# Altium schematic sheet LED Driver.SchDoc: MicroBAR - LED Driver Circuit
size A; DrawnBy: Frankie Myers; Engineer: Frankie Myers; Organization: UC Berkeley
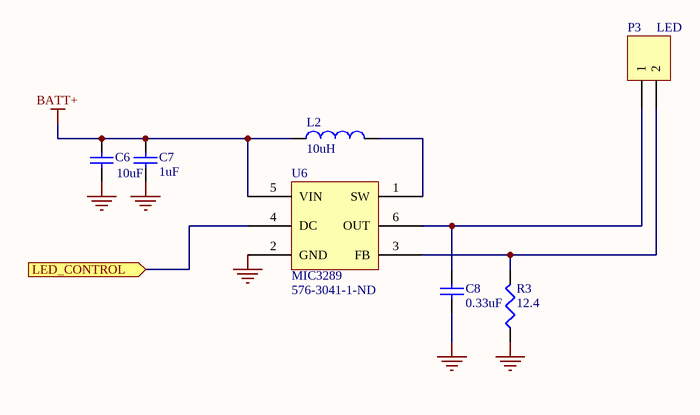
[diagram p0: LED Driver.SchDoc]

## Parts
C6  value 10uF  [CAPC3216L]  (hidden comment: Cap)
C7  value 1uF  [CAPC3216L]  (hidden comment: Cap Semi)
C8  value 0.33uF  [CAPC3216L]  (hidden comment: Cap Semi)
L2  value 10uH  [MURATA SMT INDUCTOR]  (hidden comment: Inductor)
P3  LED  [2MM JST PH - 2 PIN]
R3  value 12.4  [RESC3216L]  (hidden comment: Res3)
U6  MIC3289  Supplier Part Number 1: 576-3041-1-ND  [SOT-23_A]

## Ports
LED_CONTROL

## Nets
BATT+: C6.2 C7.2 L2.1 U6.5(VIN)
GND: C6.1 C7.1 C8.1 R3.1 U6.2(GND)
LED_CONTROL: U6.4(DC) ; port LED_CONTROL
NetC8_2: C8.2 P3.1 U6.6(OUT)
NetL2_2: L2.2 U6.1(SW)
NetP3_2: P3.2 R3.2 U6.3(FB)

## Library data of the parts
C6 = Cap: Capacitor; Published: 8-Jun-2000; LatestRevisionDate: 17-Jul-2002; LatestRevisionNote: Re-released for DXP Platform.; PackageReference: RAD-0.3; Publisher: Altium Limited
C7 C8 = Cap Semi: Capacitor (Semiconductor SIM Model); Published: 8-Jun-2000; LatestRevisionDate: 29-May-2009; LatestRevisionNote: IPC-7351 Footprint Added.; PackageReference: C1206; Publisher: Altium Limited; PackageDescription: Chip Capacitor
L2 = Inductor: Code_IEC: 1005; Published: 8-Jun-2000; LatestRevisionDate: 29-May-2009; LatestRevisionNote: IPC-7351 Footprint Added.; PackageReference: 0402-A; Publisher: Altium Limited; PackageDescription: Chip Inductor; Code_JEITA: 0402
P3 = Header 2: Header, 2-Pin; LatestRevisionDate: 17-Jul-2002; LatestRevisionNote: Re-released for DXP Platform.; Publisher: Altium Limited
R3 = Res3: Resistor; Published: 8-Jun-2000; LatestRevisionDate: 29-May-2009; LatestRevisionNote: IPC-7351 Footprint Added.; PackageReference: J1-0603; Publisher: Altium Limited; PackageDescription: Chip Resistor
U6 = MIC3289: Supplier 1: Digi-Key